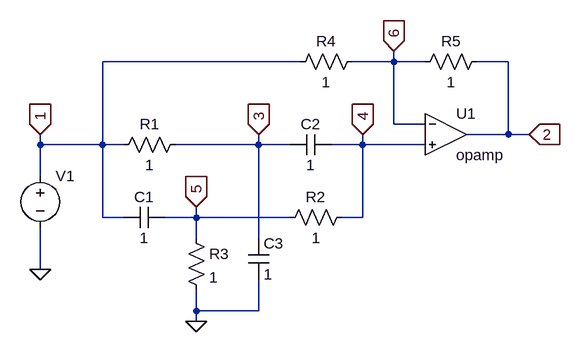
[diagram p0: schematic Twin-T-all-pass.asc]
Twin-T-all-pass.asc, the LTspice schematic file:
Version 4
SHEET 1 1056 712
WIRE 80 16 -224 16
WIRE 224 16 224 0
WIRE 224 16 160 16
WIRE 272 16 224 16
WIRE 400 16 352 16
WIRE 224 112 224 16
WIRE 272 112 224 112
WIRE 400 128 400 16
WIRE 400 128 336 128
WIRE 432 128 400 128
WIRE -320 144 -320 128
WIRE -224 144 -224 16
WIRE -224 144 -320 144
WIRE -192 144 -224 144
WIRE 16 144 16 128
WIRE 16 144 -112 144
WIRE 64 144 16 144
WIRE 176 144 176 128
WIRE 176 144 128 144
WIRE 272 144 176 144
WIRE -320 192 -320 144
WIRE -224 256 -224 144
WIRE -192 256 -224 256
WIRE -80 256 -80 240
WIRE -80 256 -128 256
WIRE 64 256 -80 256
WIRE 176 256 176 144
WIRE 176 256 144 256
WIRE -80 288 -80 256
WIRE 16 288 16 144
WIRE -320 336 -320 272
WIRE -80 400 -80 368
WIRE 16 400 16 352
WIRE 16 400 -80 400
WIRE -80 416 -80 400
FLAG -320 336 0
FLAG -320 128 1
IOPIN -320 128 In
FLAG 432 128 2
IOPIN 432 128 In
FLAG 16 128 3
IOPIN 16 128 In
FLAG -80 240 5
IOPIN -80 240 In
FLAG 176 128 4
IOPIN 176 128 In
FLAG -80 416 0
FLAG 224 0 6
IOPIN 224 0 In
SYMBOL res -96 128 R90
WINDOW 0 0 56 VBottom 2
WINDOW 3 32 56 VTop 2
SYMATTR InstName R1
SYMATTR Value 1
SYMBOL res 160 240 R90
WINDOW 0 0 56 VBottom 2
WINDOW 3 32 56 VTop 2
SYMATTR InstName R2
SYMATTR Value 1
SYMBOL res -96 272 R0
SYMATTR InstName R3
SYMATTR Value 1
SYMBOL cap -128 240 R90
WINDOW 0 0 32 VBottom 2
WINDOW 3 32 32 VTop 2
SYMATTR InstName C1
SYMATTR Value 1
SYMBOL cap 128 128 R90
WINDOW 0 0 32 VBottom 2
WINDOW 3 32 32 VTop 2
SYMATTR InstName C2
SYMATTR Value 1
SYMBOL cap 0 288 R0
SYMATTR InstName C3
SYMATTR Value 1
SYMBOL voltage -320 176 R0
WINDOW 3 34 89 Invisible 2
WINDOW 39 0 0 Left 0
WINDOW 123 0 0 Left 0
SYMATTR Value 1
SYMATTR InstName V1
SYMBOL OpAmps\\opamp 304 64 R0
SYMATTR InstName U1
SYMBOL res 176 0 R90
WINDOW 0 0 56 VBottom 2
WINDOW 3 32 56 VTop 2
SYMATTR InstName R4
SYMATTR Value 1
SYMBOL res 368 0 R90
WINDOW 0 0 56 VBottom 2
WINDOW 3 32 56 VTop 2
SYMATTR InstName R5
SYMATTR Value 1

The netlist it stands for:
* Twin-T-all-pass.asc
R1 3 1 1
R2 4 5 1
R3 5 0 1
C1 5 1 1
C2 4 3 1
C3 3 0 1
V1 1 0 1
XU1 6 4 2 opamp Aol=100K GBW=10Meg  ; pins invin noninvin out
R4 6 1 1
R5 2 6 1
.backanno
.end